# EAGLE design board (EAGLE 9.6.2)
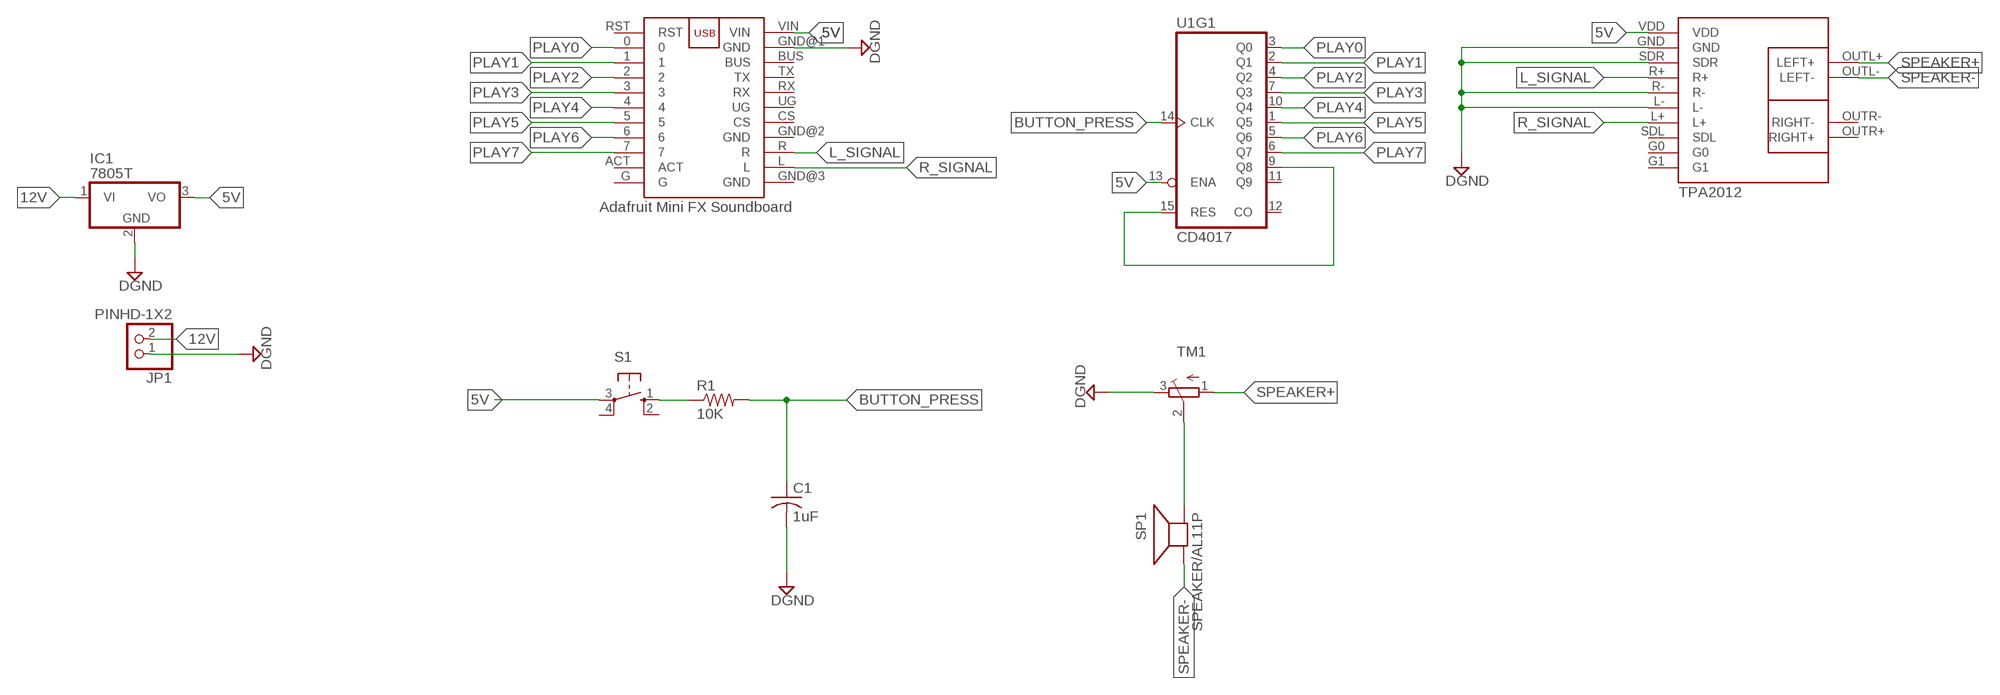
[diagram p0: schematic, sheet 1]

## Parts
C1  1uF  C-US025-050X050  [C025-050X050]
IC1  7805T  [TO220H]
JP1  PINHD-1X2  [1X02]
R1  10K  R-US_0204/5  [0204/5]
S1  10-XX  [B3F-10XX]
SP1  SPEAKER/AL11P  [AL11P]
TM1  TRIMPOT3386  [TRIM-3386]
U1  CD4017  [DIP16]
U$1  TPA2012  [TPA2012]
U$2  ADAFRUIT_AUDIO_FX_MINI_SOUNDBOARD  [ADAFRUIT_AUDIO_FX_MINI_SOUNDBOARD]

## Nets
5V: IC1.3(VO) S1.3(P) U1.13(ENA) U$1.VDD U$2.VIN
12V: IC1.1(VI) JP1.2
BUTTON_PRESS: C1.1 R1.2 U1.14(CLK)
DGND: C1.2 IC1.2(GND) JP1.1 TM1.3(E) U$1.GND U$1.L- U$1.R- U$1.SDR U$2.GND@1(GND)
L_SIGNAL: U$1.R+ U$2.R
N$1: U1.9(Q8) U1.15(RES)
N$4: R1.1 S1.1(S)
N$6: SP1.+ TM1.2(S)
N$10: U1.11(Q9)
PLAY0: U1.3(Q0) U$2.0
PLAY1: U1.2(Q1) U$2.1
PLAY2: U1.4(Q2) U$2.2
PLAY3: U1.7(Q3) U$2.3
PLAY4: U1.10(Q4) U$2.4
PLAY5: U1.1(Q5) U$2.5
PLAY6: U1.5(Q6) U$2.6
PLAY7: U1.6(Q7) U$2.7
R_SIGNAL: U$1.L+ U$2.L
SPEAKER+: TM1.1(A) U$1.OUTL+(LEFT+)
SPEAKER-: SP1.- U$1.OUTL-(LEFT-)
Unconnected: S1.2(S1) S1.4(P1) U1.8(P$V-) U1.12(CO) U1.16(P$V+) U$1.G0 U$1.G1 U$1.OUTR+(RIGHT+) U$1.OUTR-(RIGHT-) U$1.SDL U$2.ACT U$2.BUS U$2.CS U$2.G U$2.GND@2(GND) U$2.GND@3(GND) U$2.RST U$2.RX U$2.TX U$2.UG

## Library data of the parts
C1 = rcl:C-US: CAPACITOR, American symbol; SPICEPREFIX: C
IC1 = linear:78*: Positive VOLTAGE REGULATOR Source: http://cache.national.com/ds/LM/LM78L05.pdf http://www.fairchildsemi.com/ds/LM/LM7805.pdf
JP1 = Connector:PINHD-1X2: PIN HEADER; CATEGORY: CONNECTOR; SUB-CATEGORY: PIN-HEADER
R1 = BeagleBone_Black_Wireless:R-US_: RESISTOR, American symbol
S1 = switch-omron:10-XX: OMRON SWITCH; MPN: B3F-1000; OC_FARNELL: 176432; OC_NEWARK: 36M3542
SP1 = adafruit:SPEAKER: SPEAKER Source: Buerklin Added PS12 (for part # PS1240 piezo) http://www.ladyada.net/library/pcb/eaglelibrary.html
TM1 = adafruit:TRIMPOT: SMT trimmer potentiometer part number TC33X http://www.ladyada.net/library/eagle
U1 = SparkFun-IC-Logic:CD4017: 10-Out Decade Counter Datasheet <https://cdn.sparkfun.com/datasheets/Kits/cd4022b.pdf> SparkFun Products SparkFun SparkPunk Sequencer Kit <https://www.sparkfun.com/products/12707> (KIT-12707); PROD_ID: IC-11929
U$1 = Adafruit Audio FX Sound Board:TPA2012: Component for Adafruit TPA2012/TS2012 2.1W Stereo Audio Amplifier Product Page: https://www.adafruit.com/product/1552 Datasheet: https://cdn-shop.adafruit.com/product-files/1552/tpa2012d2.pdf
U$2 = Adafruit Audio FX Sound Board:ADAFRUIT_AUDIO_FX_MINI_SOUNDBOARD: Component for Adafruit Audio FX Mini Soundboard Product Page: https://www.adafruit.com/product/2341 Datasheet: https://cdn-shop.adafruit.com/datasheets/vs1000.pdf

## Board
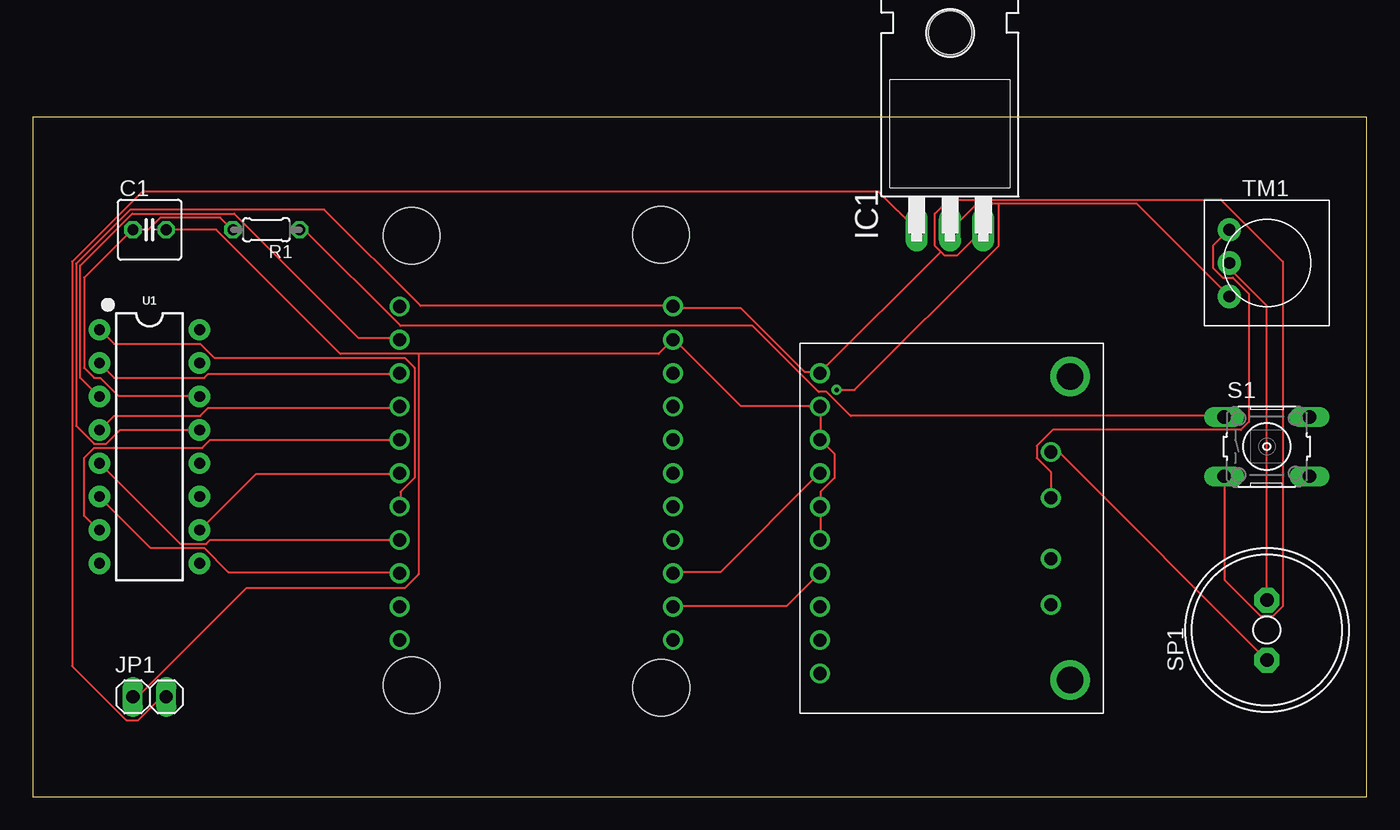
[diagram p1: board, top side]
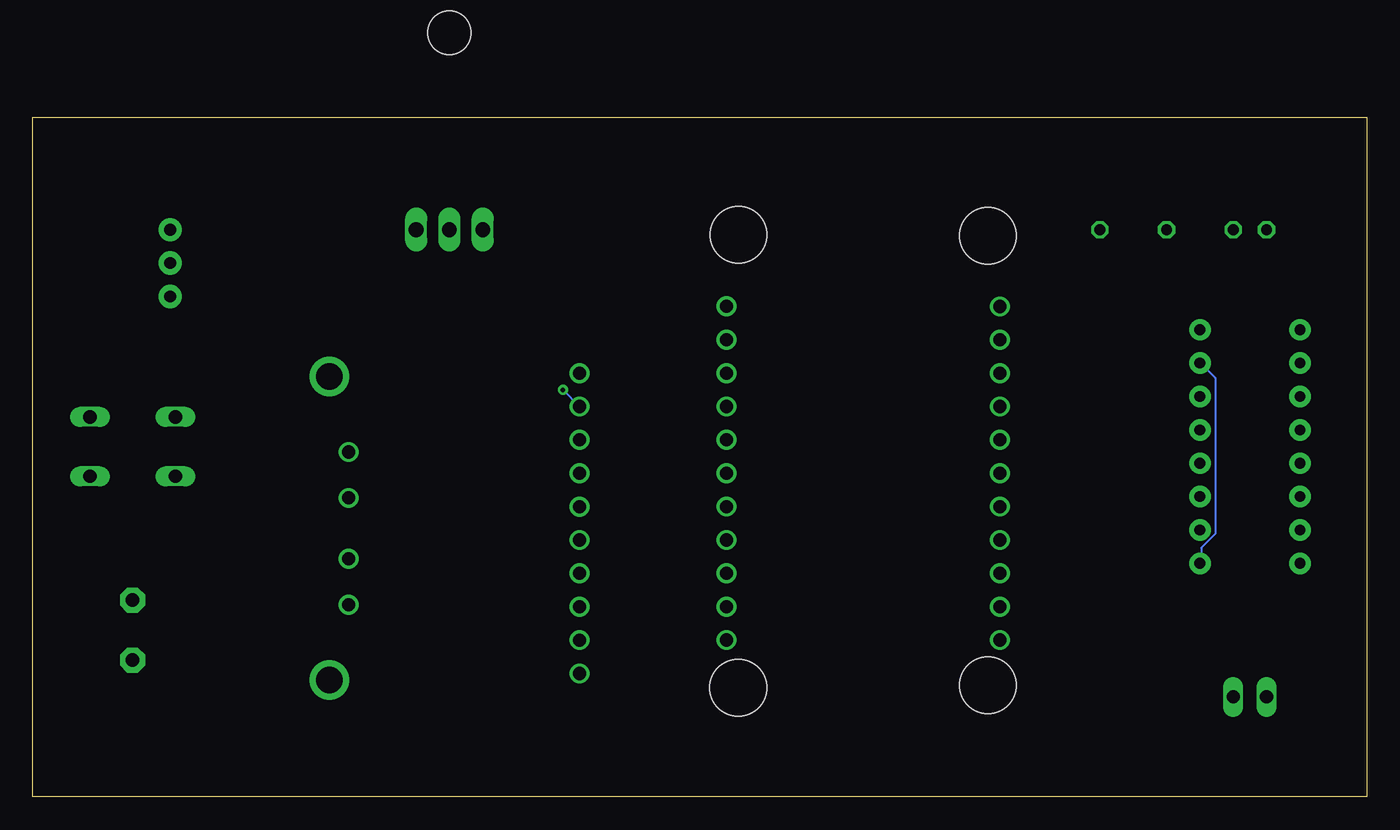
[diagram p2: board, bottom side, seen from below]

Size 101.58 x 51.74 mm. Coordinates in mm from the lower left corner, seen from the top.
Outline: 0,0 101.58,0 101.58,51.74 0,51.74 0,0
Copper layers (1*16): Top 0.035mm / dielectric 1.5mm / Bottom 0.035mm
Design rules "default": minimum track width 6mil, minimum drill 0.35mm, track to track 6mil, track to pad 6mil, pad to pad 6mil, via to via 6mil, smd to smd 6mil, copper to edge 40mil, drill to drill 6mil, minimum pad ring 10mil, minimum via ring 8mil, stop-mask expansion 4mil, vias tented up to drill 0mil, thermal gap 10mil

### Footprints (pad centres in the part's own frame; a part is rotated, then mirrored left to right if it is on the bottom)
C025-050X050 = drill 0.813 octagon: 1 -1.27,0; 2 1.27,0
TO220H = drill 1.118 long: 1 -2.54,-10.16; 2 0,-10.16; 3 2.54,-10.16 | hole 3.302: 0,4.826
1X02 = drill 1.016 long: 1 -1.27,0; 2 1.27,0
0204/5 = drill 0.813 octagon: 1 -2.54,0; 2 2.54,0
B3F-10XX = drill 1.016 long: 1 -3.251,2.261; 2 3.251,2.261; 3 -3.251,-2.261; 4 3.251,-2.261
AL11P = drill 1.016 pad 1.905 octagon: + 2.286,0; - -2.286,0
TRIM-3386 = drill 0.9 pad 1.778: 1 -2.54,-2.857; 2 0,-2.857; 3 2.54,-2.857
DIP16 = drill 0.813 pad 1.626: 1 -8.89,-3.81; 2 -6.35,-3.81; 3 -3.81,-3.81; 4 -1.27,-3.81; 5 1.27,-3.81; 6 3.81,-3.81; 7 6.35,-3.81; 8 8.89,-3.81; 9 8.89,3.81; 10 6.35,3.81; 11 3.81,3.81; 12 1.27,3.81; 13 -1.27,3.81; 14 -3.81,3.81; 15 -6.35,3.81; 16 -8.89,3.81
TPA2012 = drill 1: G0 1.524,5.588; G1 1.524,3.048; GND 1.524,23.368; L+ 1.524,10.668; L- 1.524,13.208; OUTL+ 19.114,16.411; OUTL- 19.114,19.911; OUTR+ 19.114,8.283; OUTR- 19.114,11.783; R+ 1.524,18.288; R- 1.524,15.748; SDL 1.524,8.128; SDR 1.524,20.828; VDD 1.524,25.908 | drill 2: GAIN0 20.574,25.654; GAIN1 20.574,2.54
ADAFRUIT_AUDIO_FX_MINI_SOUNDBOARD = drill 1: 0 1.27,28.45; 1 1.27,25.91; 2 1.27,23.37; 3 1.27,20.83; 4 1.27,18.29; 5 1.27,15.75; 6 1.27,13.21; 7 1.27,10.67; ACT 1.27,8.13; BUS 22.09,25.91; CS 22.09,15.75; G 1.27,5.59; GND@1 22.09,28.45; GND@2 22.09,13.21; GND@3 22.09,5.59; L 22.09,8.13; R 22.09,10.67; RST 1.27,30.98; RX 22.09,20.83; TX 22.09,23.37; UG 22.09,18.29; VIN 22.09,30.99 | hole 4.318: 2.159,2.159; 21.189,1.974; 21.181,36.436; 2.159,36.366

### Placement (x,y rotation side)
C1  8.89,43.18 0 top
IC1  69.85,53.34 0 top
JP1  8.89,7.62 0 top
R1  17.78,43.18 180 top
S1  93.98,26.67 0 top
SP1  93.98,12.7 90 top
TM1  93.98,40.64 270 top
U1  8.89,26.67 270 top
U$1  58.42,6.35 0 top
U$2  26.67,6.35 0 top

### Tracks (layer width: path | path; a pad name or v marks a point on that pad's centre or on a via)
5V
  Top 0.152: 69.14,41.5 69.44,41.2 70.36,41.2 72.34,43.18 IC1.3 | 69.14,41.5 68.68,41.96 68.68,44.4 69.75,45.47 90.48,45.47 95.2,40.74 95.2,14.53 94.44,13.77 93.52,13.77 90.78,16.51 90.78,24.28 S1.3 | U1.13 6.66,27.94 5.59,26.87 4.67,26.87 3.3,28.24 3.3,40.59 7.42,44.7 22.2,44.7 29.52,37.39 48.72,37.39 U$2.VIN 48.87,37.24 53.9,37.24 58.78,32.36 59.84,32.36 U$1.VDD 60,32.36 69.14,41.5
12V
  Top 0.152: IC1.1 64.41,46.08 8.33,46.08 3,40.74 3,9.96 7.11,5.84 8.03,5.84 9.7,7.52 10.16,7.52 JP1.2
BUTTON_PRESS
  Top 0.152: R1.2 15.19,43.18 14.27,44.09 9.7,44.09 8.79,43.18 C1.1 7.57,43.18 3.91,39.52 3.91,32.66 4.67,31.9 5.13,31.9 6.5,30.53 12.6,30.53 U1.14
DGND  (via drill 0.35)
  Top 0.152: 73.56,45.16 84.07,45.16 91.08,38.15 TM1.3 | 73.56,45.16 71.88,45.16 69.9,43.18 IC1.2 | U$1.L- 60,19.56 60,22 U$1.R- 60,22.15 60,23.22 61.06,24.28 61.06,26.11 60,27.18 | 60,27.18 60,29.62 U$1.GND 59.84,29.77 53.9,29.77 48.87,34.8 U$2.GND@1 48.72,34.8 47.65,33.73 29.36,33.73 | 60,27.18 U$1.SDR | C1.2 13.97,43.18 23.42,33.73 29.36,33.73 | 29.36,33.73 29.36,16.97 28.3,15.9 16.26,15.9 8.03,7.67 7.72,7.67 JP1.1 | 73.56,45.16 73.56,41.96 62.59,30.99 v61.21,30.99
  Bottom 0.152: U$1.GND v61.21,30.99
L_SIGNAL
  Top 0.152: U$2.R 48.87,17.12 52.38,17.12 59.84,24.59 U$1.R+
N$1
  Bottom 0.152: U1.9 12.6,17.88 12.6,18.95 11.53,20.02 11.53,31.9 12.6,32.97 U1.15
N$4
  Top 0.152: R1.1 20.68,43.18 27.99,35.87 54.81,35.87 59.84,30.84 60.45,30.84 62.28,29.01 90.63,29.01 S1.1
N$6
  Top 0.152: SP1.+ 93.98,37.39 91.24,40.13 91.24,40.59 TM1.2
PLAY0
  Top 0.152: U$2.0 27.84,34.95 24.79,34.95 15.34,44.4 7.57,44.4 3.61,40.44 3.61,31.9 4.98,30.53 U1.3
PLAY1
  Top 0.152: U1.2 6.2,31.9 13.06,31.9 13.36,32.21 27.84,32.21 U$2.1
PLAY2
  Top 0.152: U$2.2 27.84,29.62 13.36,29.62 12.75,29.01 6.2,29.01 5.13,27.94 U1.4
PLAY3
  Top 0.152: U$2.3 27.84,27.18 13.51,27.18 12.9,26.57 4.67,26.57 3.91,25.81 3.91,21.39 4.98,20.32 U1.7
PLAY4
  Top 0.152: U$2.4 27.84,24.59 17.02,24.59 12.75,20.32 U1.10
PLAY5
  Top 0.152: U$2.5 27.99,22.15 27.99,23.22 29.06,24.28 29.06,32.66 28.3,33.43 13.82,33.43 12.75,34.49 6.2,34.49 5.13,35.56 U1.1
PLAY6
  Top 0.152: U1.5 11.23,19.25 13.21,19.25 13.51,19.56 27.84,19.56 U$2.6
PLAY7
  Top 0.152: U$2.7 27.84,17.12 14.88,17.12 13.06,18.95 8.94,18.95 5.13,22.76 U1.6
R_SIGNAL
  Top 0.152: U$2.L 48.87,14.53 57.4,14.53 59.84,16.97 U$1.L+
SPEAKER+
  Top 0.152: U$1.OUTL+ 77.52,22.91 77.52,24.74 76.45,25.81 76.45,26.72 77.67,27.94 92,27.94 92.61,28.55 92.61,38.3 91.39,39.52 90.63,39.52 89.86,40.28 89.86,41.96 91.08,43.18 TM1.1
SPEAKER-
  Top 0.152: SP1.- 78.28,26.11 77.67,26.11 U$1.OUTL-